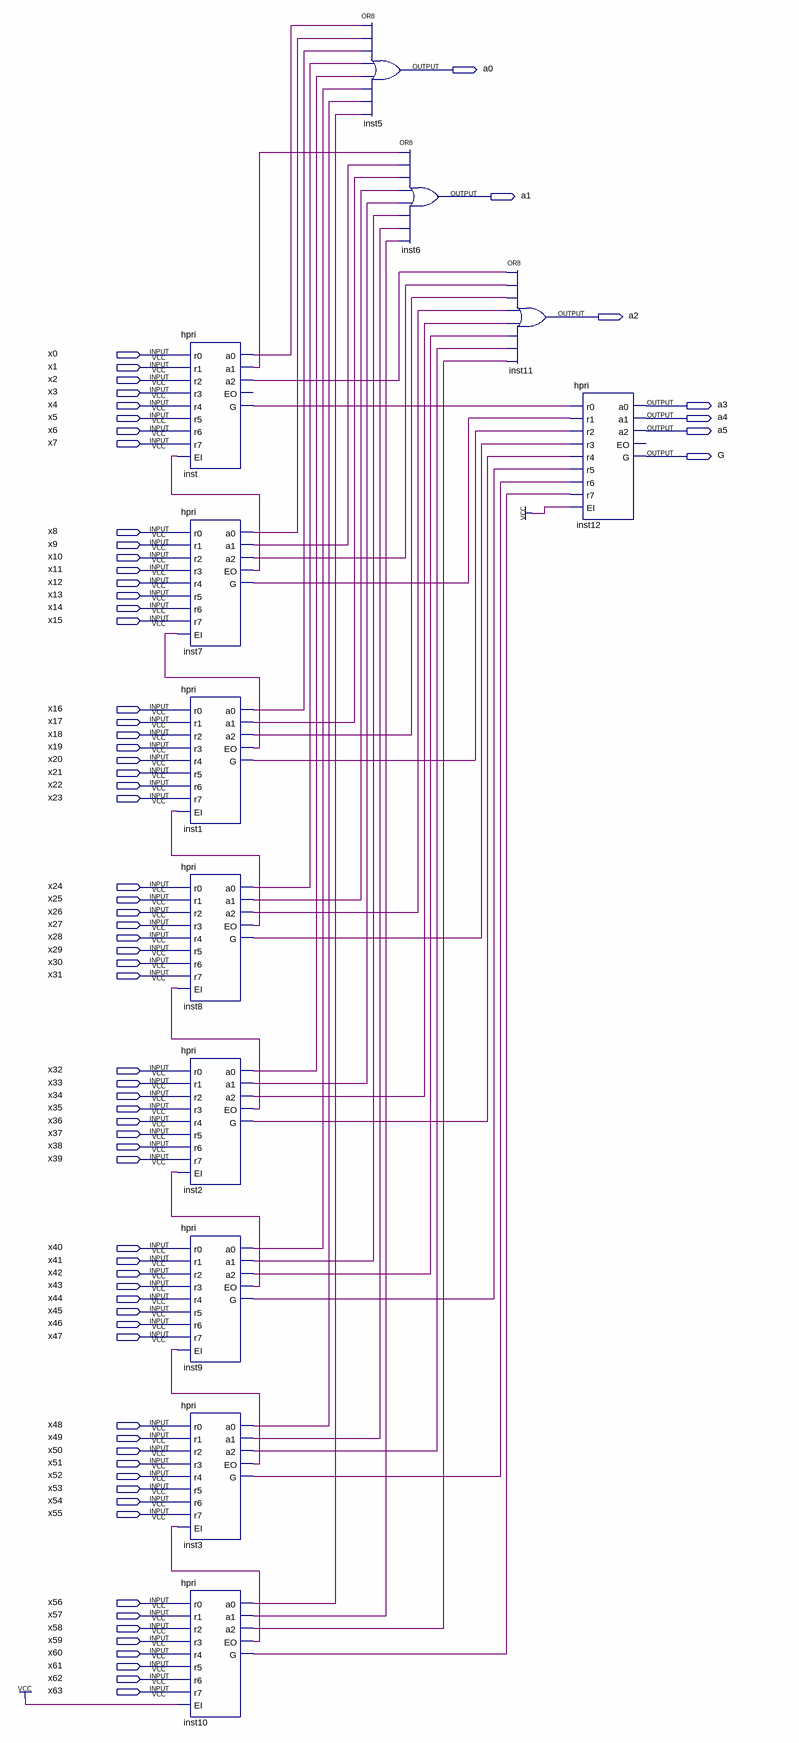
[diagram p0: schematic sheet]
// Quartus schematic double_coder.bdf as structural Verilog: 12 symbols, 71 pins
module double_coder (
  input  x0,
  input  x1,
  input  x2,
  input  x3,
  input  x4,
  input  x5,
  input  x6,
  input  x7,
  input  x8,
  input  x9,
  input  x10,
  input  x11,
  input  x12,
  input  x13,
  input  x14,
  input  x15,
  input  x16,
  input  x17,
  input  x18,
  input  x19,
  input  x20,
  input  x21,
  input  x22,
  input  x23,
  input  x24,
  input  x25,
  input  x26,
  input  x27,
  input  x28,
  input  x29,
  input  x30,
  input  x31,
  input  x32,
  input  x33,
  input  x34,
  input  x35,
  input  x36,
  input  x37,
  input  x38,
  input  x39,
  input  x40,
  input  x41,
  input  x42,
  input  x43,
  input  x44,
  input  x45,
  input  x46,
  input  x47,
  input  x48,
  input  x49,
  input  x50,
  input  x51,
  input  x52,
  input  x53,
  input  x54,
  input  x55,
  input  x56,
  input  x57,
  input  x58,
  input  x59,
  input  x60,
  input  x61,
  input  x62,
  input  x63,
  output a0,
  output a1,
  output a2,
  output a3,
  output a4,
  output a5,
  output G
);

  wire inst1_a0, inst1_a1, inst1_a2, inst1_eo, inst1_g, inst2_a0, inst2_a1, inst2_a2, inst2_eo, inst2_g,
       inst3_a0, inst3_a1, inst3_a2, inst3_eo, inst3_g, inst7_a0, inst7_a1, inst7_a2, inst7_eo, inst7_g,
       inst8_a0, inst8_a1, inst8_a2, inst8_eo, inst8_g, inst9_a0, inst9_a1, inst9_a2, inst9_eo, inst9_g,
       inst10_a0, inst10_a1, inst10_a2, inst10_eo, inst10_g, inst_a0, inst_a1, inst_a2, inst_g;

  hpri inst (
    .r0(x0), .r1(x1), .r2(x2), .r3(x3), .r4(x4), .r5(x5), .r6(x6), .r7(x7), .EI(inst7_eo), .a0(inst_a0),
    .a1(inst_a1), .a2(inst_a2), .G(inst_g));  // open: EO
  hpri inst7 (
    .r0(x8), .r1(x9), .r2(x10), .r3(x11), .r4(x12), .r5(x13), .r6(x14), .r7(x15), .EI(inst1_eo),
    .a0(inst7_a0), .a1(inst7_a1), .a2(inst7_a2), .EO(inst7_eo), .G(inst7_g));
  hpri inst1 (
    .r0(x16), .r1(x17), .r2(x18), .r3(x19), .r4(x20), .r5(x21), .r6(x22), .r7(x23), .EI(inst8_eo),
    .a0(inst1_a0), .a1(inst1_a1), .a2(inst1_a2), .EO(inst1_eo), .G(inst1_g));
  hpri inst8 (
    .r0(x24), .r1(x25), .r2(x26), .r3(x27), .r4(x28), .r5(x29), .r6(x30), .r7(x31), .EI(inst2_eo),
    .a0(inst8_a0), .a1(inst8_a1), .a2(inst8_a2), .EO(inst8_eo), .G(inst8_g));
  hpri inst2 (
    .r0(x32), .r1(x33), .r2(x34), .r3(x35), .r4(x36), .r5(x37), .r6(x38), .r7(x39), .EI(inst9_eo),
    .a0(inst2_a0), .a1(inst2_a1), .a2(inst2_a2), .EO(inst2_eo), .G(inst2_g));
  hpri inst9 (
    .r0(x40), .r1(x41), .r2(x42), .r3(x43), .r4(x44), .r5(x45), .r6(x46), .r7(x47), .EI(inst3_eo),
    .a0(inst9_a0), .a1(inst9_a1), .a2(inst9_a2), .EO(inst9_eo), .G(inst9_g));
  hpri inst3 (
    .r0(x48), .r1(x49), .r2(x50), .r3(x51), .r4(x52), .r5(x53), .r6(x54), .r7(x55), .EI(inst10_eo),
    .a0(inst3_a0), .a1(inst3_a1), .a2(inst3_a2), .EO(inst3_eo), .G(inst3_g));
  hpri inst10 (
    .r0(x56), .r1(x57), .r2(x58), .r3(x59), .r4(x60), .r5(x61), .r6(x62), .r7(x63), .EI(1'b1),
    .a0(inst10_a0), .a1(inst10_a1), .a2(inst10_a2), .EO(inst10_eo), .G(inst10_g));
  or inst5 (a0, inst_a0, inst7_a0, inst1_a0, inst8_a0, inst2_a0, inst9_a0, inst3_a0, inst10_a0);
  or inst6 (a1, inst_a1, inst7_a1, inst1_a1, inst8_a1, inst2_a1, inst9_a1, inst3_a1, inst10_a1);
  or inst11 (a2, inst_a2, inst7_a2, inst1_a2, inst8_a2, inst2_a2, inst9_a2, inst3_a2, inst10_a2);
  hpri inst12 (
    .r0(inst_g), .r1(inst7_g), .r2(inst1_g), .r3(inst8_g), .r4(inst2_g), .r5(inst9_g), .r6(inst3_g),
    .r7(inst10_g), .EI(1'b1), .a0(a3), .a1(a4), .a2(a5), .G(G));  // open: EO
endmodule
